# EasyEDA schematic schema.easyeda.json
TITLE: Camera Mod; Date: 2019-09-26; Drawn By: kongaskristjan
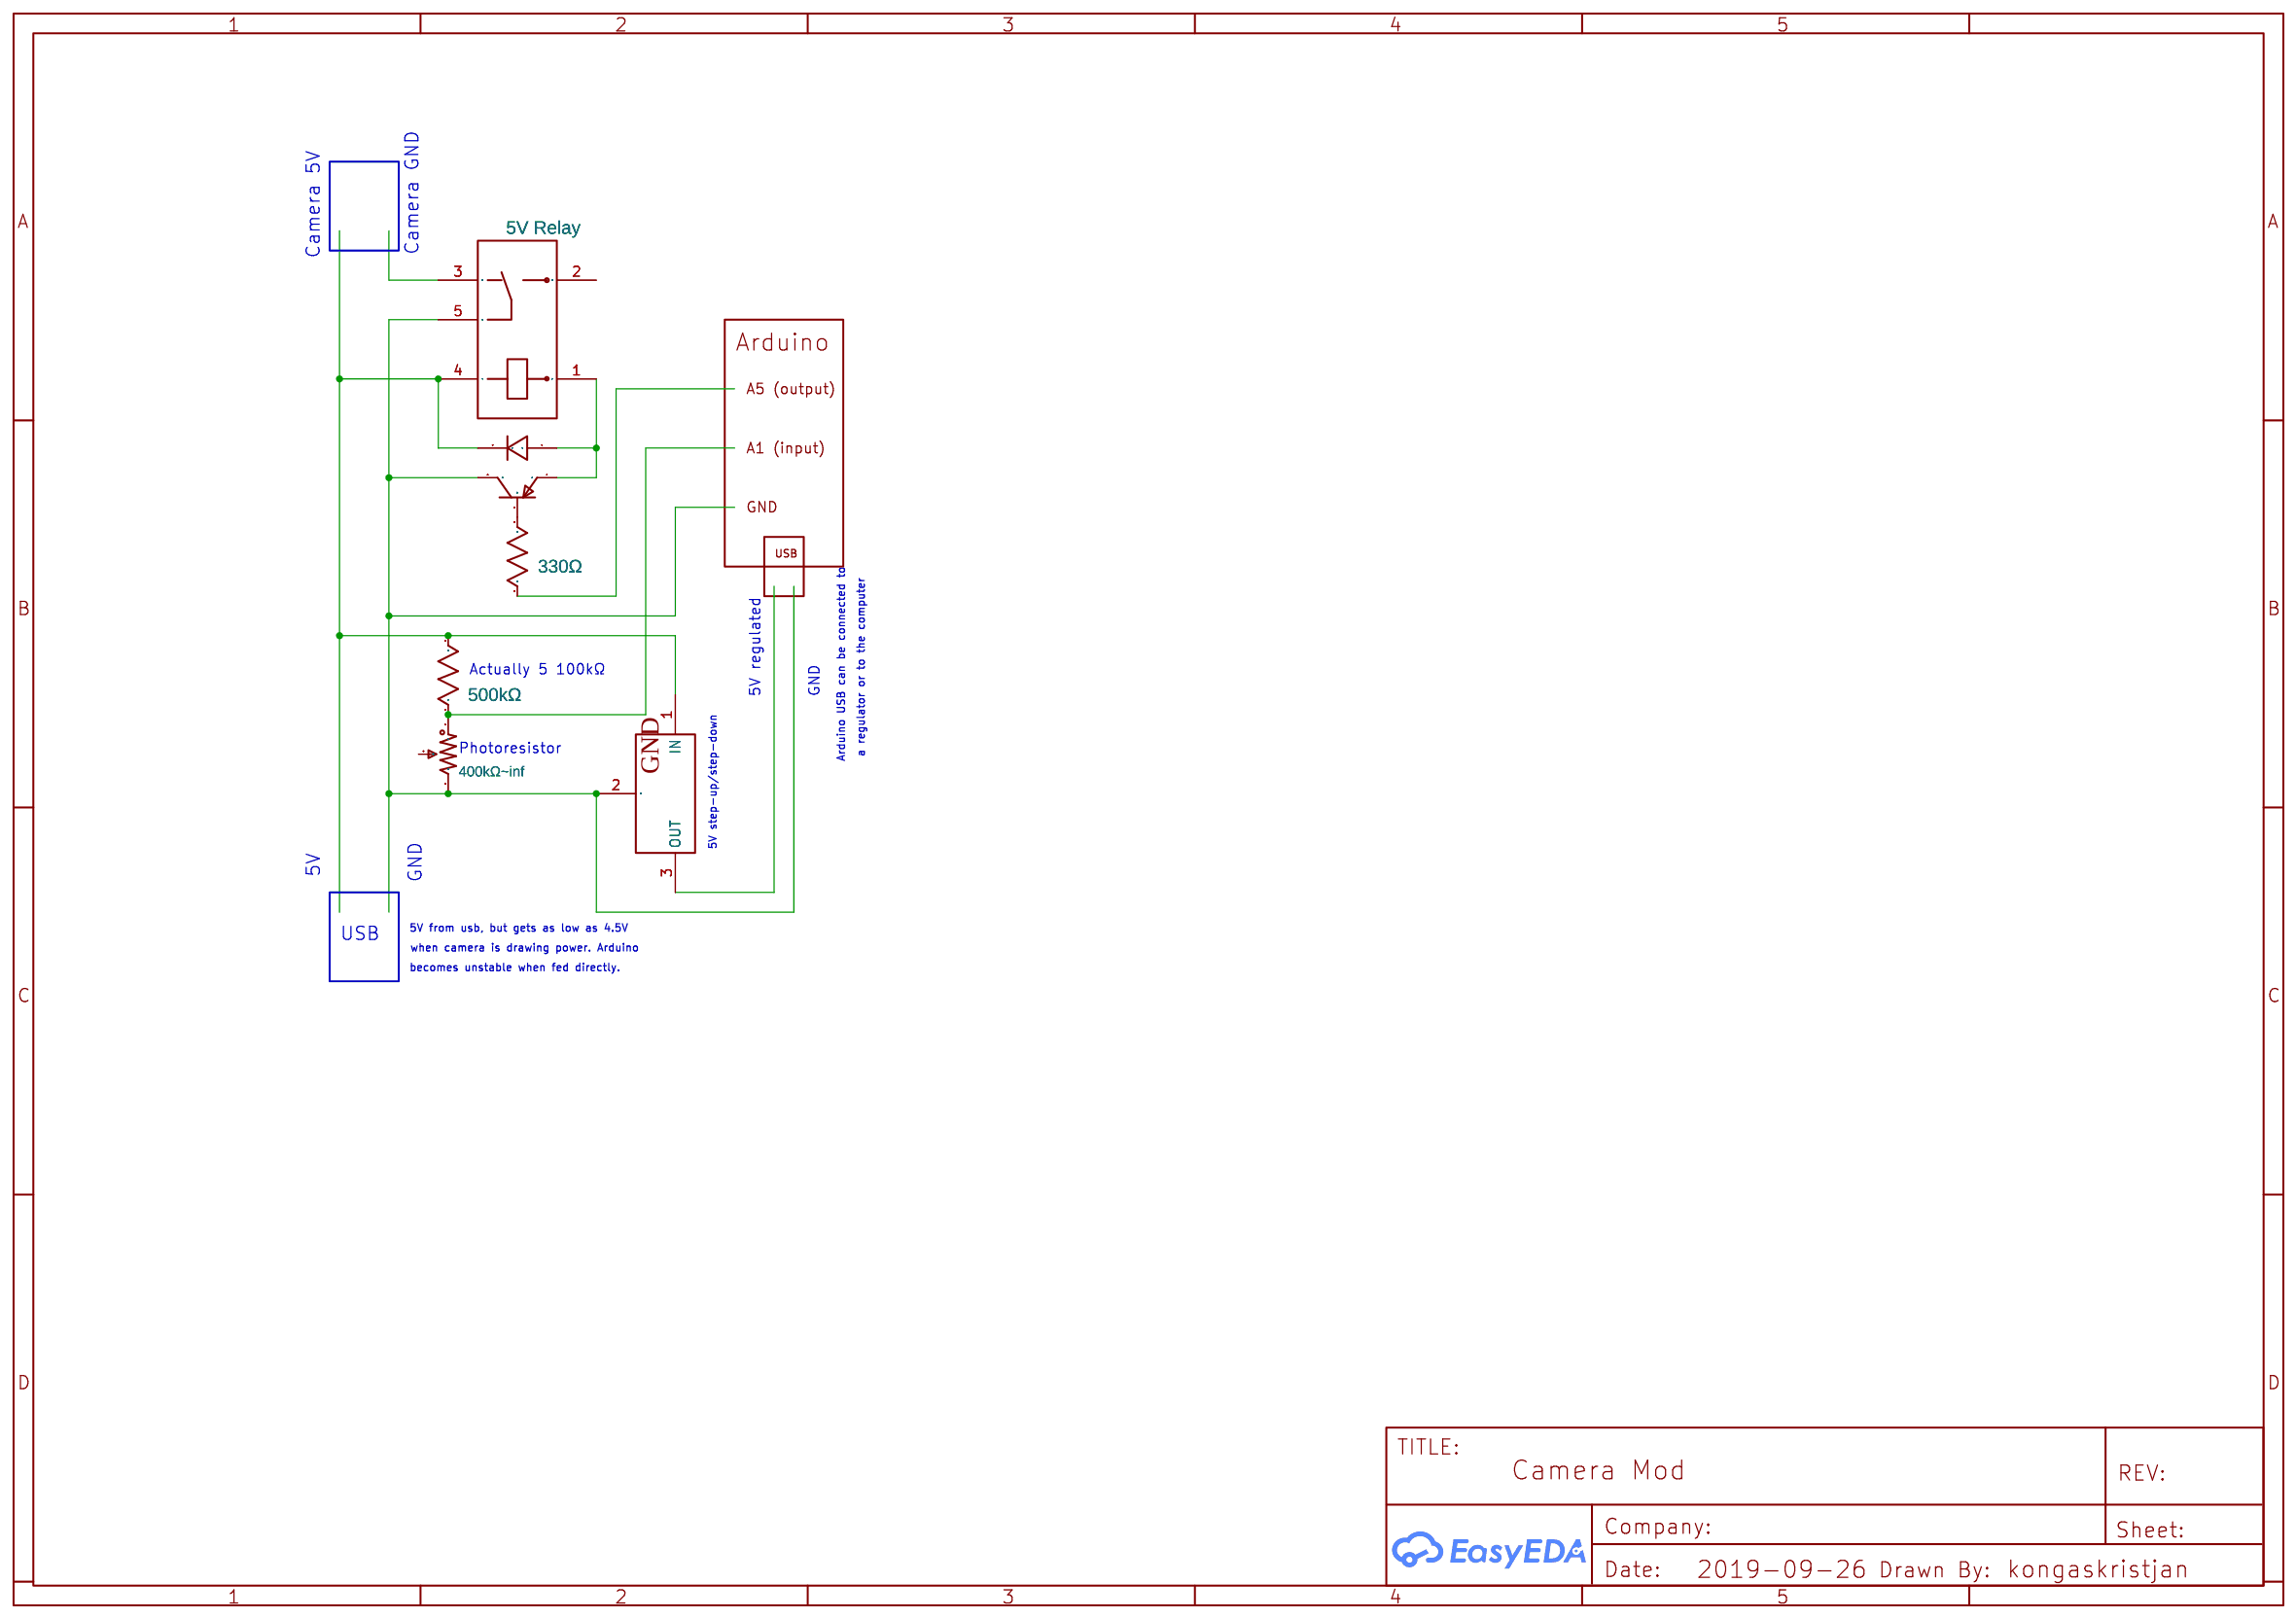
[diagram p0: schematic sheet]

## Parts
5V  S7V7F5  [TO-220(TO-220-3)]
ARDUINO  none
D1  1N4448  [DO-35]
K1  5V Relay  [RELAY-SL-SRD]
Q1  2N3906  [TO-92(TO-92-3)]
R1  330Ω  [AXIAL-0.3]
R2  500kΩ  [AXIAL-0.3]
R3  400kΩ~inf  [RES-3386]

## Library data of the parts
5V = -: Supplier: LCSC; Manufacturer: STMicroelectronics; Manufacturer Part: L7805ABV; image: //image.lceda.cn/szlcsc/C16807.jpg; Supplier Part: C16807
D1 = -: Supplier: LCSC; Manufacturer: SEMTECH; image: //image.lceda.cn/szlcsc/C54037.jpg; Supplier Part: C54037
K1 = -: Supplier: LCSC; Manufacturer: SONGLE; Manufacturer Part: SRD-03VDC-SL-C; Supplier Part: C24585
Q1 = -: Supplier: LCSC; Manufacturer: CJ; image: //image.lceda.cn/szlcsc/C9809.jpg; Supplier Part: C9809
R1 R2 = Res_AXIAL-0.3(1/8W)_US
R3 = 3386P-1-103LF_US: Supplier: LCSC; Manufacturer: BOURNS; Manufacturer Part: 3386P-1-103LF; Contributor: EasyEDA; Supplier Part: C116281

## Nets
Net-(5V-1): 5V.1(IN) D1.2(K) K1.4 R2.2
Net-(5V-2): 5V.2(GND) K1.5 Q1.3(C) R3.3
Net-(D1-1): D1.1(A) K1.1 Q1.1(E)
Net-(Q1-2): Q1.2(B) R1.1
Net-(R2-1): R2.1 R3.1

Not connected (* = marked no-connect by the designer): 5V 3(OUT); K1 2 3; R1 2; R3 2

## Notes on the sheet
- Camera GND
- Camera 5V
- Actually 5 100kΩ
- GND
- 5V regulated
- Photoresistor
- Arduino USB can be connected to
- a regulator or to the computer
- 5V
- GND
- 5V step-up/step-down
- USB
- 5V from usb, but gets as low as 4.5V
- when camera is drawing power. Arduino
- becomes unstable when fed directly.
